# Altium schematic sheet POWERMANAGE2.SchDoc
size A3; SheetNumber: 11; SheetTotal: 13; SPICEModelCacheVRZJBZTH: <root> / <DocumentId>VRZJBZTH</DocumentId> / <CacheFrame Number="0"> / <Model Name="emk105bj105_v-f" Kind="CKT"> / <Text>* EMK105BJ105_V-F     SPICE MODEL  ( General Type ) / *-------------------------------------------------------------------------------------------------------- / * Model Generated by TAIYO YUDEN Corporation (http://www.ty-top.com) / * Version 1.0 / * TAIYO YUDEN Control No. 170508_130520 / * Copyright(c) 2012 TAIYO YUDEN CO.,LTD. All Rights Reserved. / *-------------------------------------------------------------------------------------------------------- / * / * Products Name : Multilayer Ceramic Capacitors / * / * Characteristics : / *     Capacitance : 1 uF , Rated Voltage : 16V , TCC : X5R / *     Case Size : 1.0 x 0.5 / 0.039 x 0.02 [mm/inch] , Thickness : 0.5 / 0.02 [mm/inch] / *     (Conditions: Temperature = 25 degC , DC Bias Current/Voltage = 0A / 0V) / * / * Frequency Range : 40Hz - 3GHz / * / * External Node Assignments : / * / *  1  o---| |---o  2 / * / *-------------------------------------------------------------------------------------------------------- / .SubCkt EMK105BJ105_V-F 1 2 / **************************** / C0 1 110 0.68309u / Cm 1 101 0.26053u / C1 101 102 0.94076u / Rc1 101 102 1.9029k / C2 102 103 0.66707u / Rc2 102 103 120.36 / C3 103 110 0.57203u / Rc3 103 110 2.1097 / C2m 1 301 0.1871u / C21 301 302 3.2494u / Rc21 301 302 1.1117k / C22 302 303 2.1014u / Rc22 302 303 1.484k / C23 303 304 2.1172u / Rc23 303 304 1.3876k / C24 304 305 0.75729u / Rc24 304 305 332.59 / C25 305 306 0.94401u / Rc25 305 306 249.09 / C26 306 307 0.34674u / Rc26 306 307 28.352 / C27 307 308 0.37158u / Rc27 307 308 19.989 / C28 308 309 0.17933u / Rc28 308 309 31.748 / C29 309 110 0.016445u / Rc29 309 110 1.0592 / Rp0 1 110 100Meg / L0 110 120 0.2216n / Lm 120 130 0.1509n / L1 120 121 0.12659n / RL1 121 130 0.85161 / L2 120 122 0.15996n / RL2 122 130 0.42469 / L3 120 123 7.9543n / RL3 123 130 0.54643m / CR 120 124 0.24334u / LR 124 125 0.090738n / RR 125 130 68.076m / CL 130 140 2.7354p / LL 130 140 0.10762n / RL 130 140 50.614 / Rs 140 2 7.5416m / **************************** / .ends EMK105BJ105_V-F</Text> / </Model> / </CacheFrame> / </root>
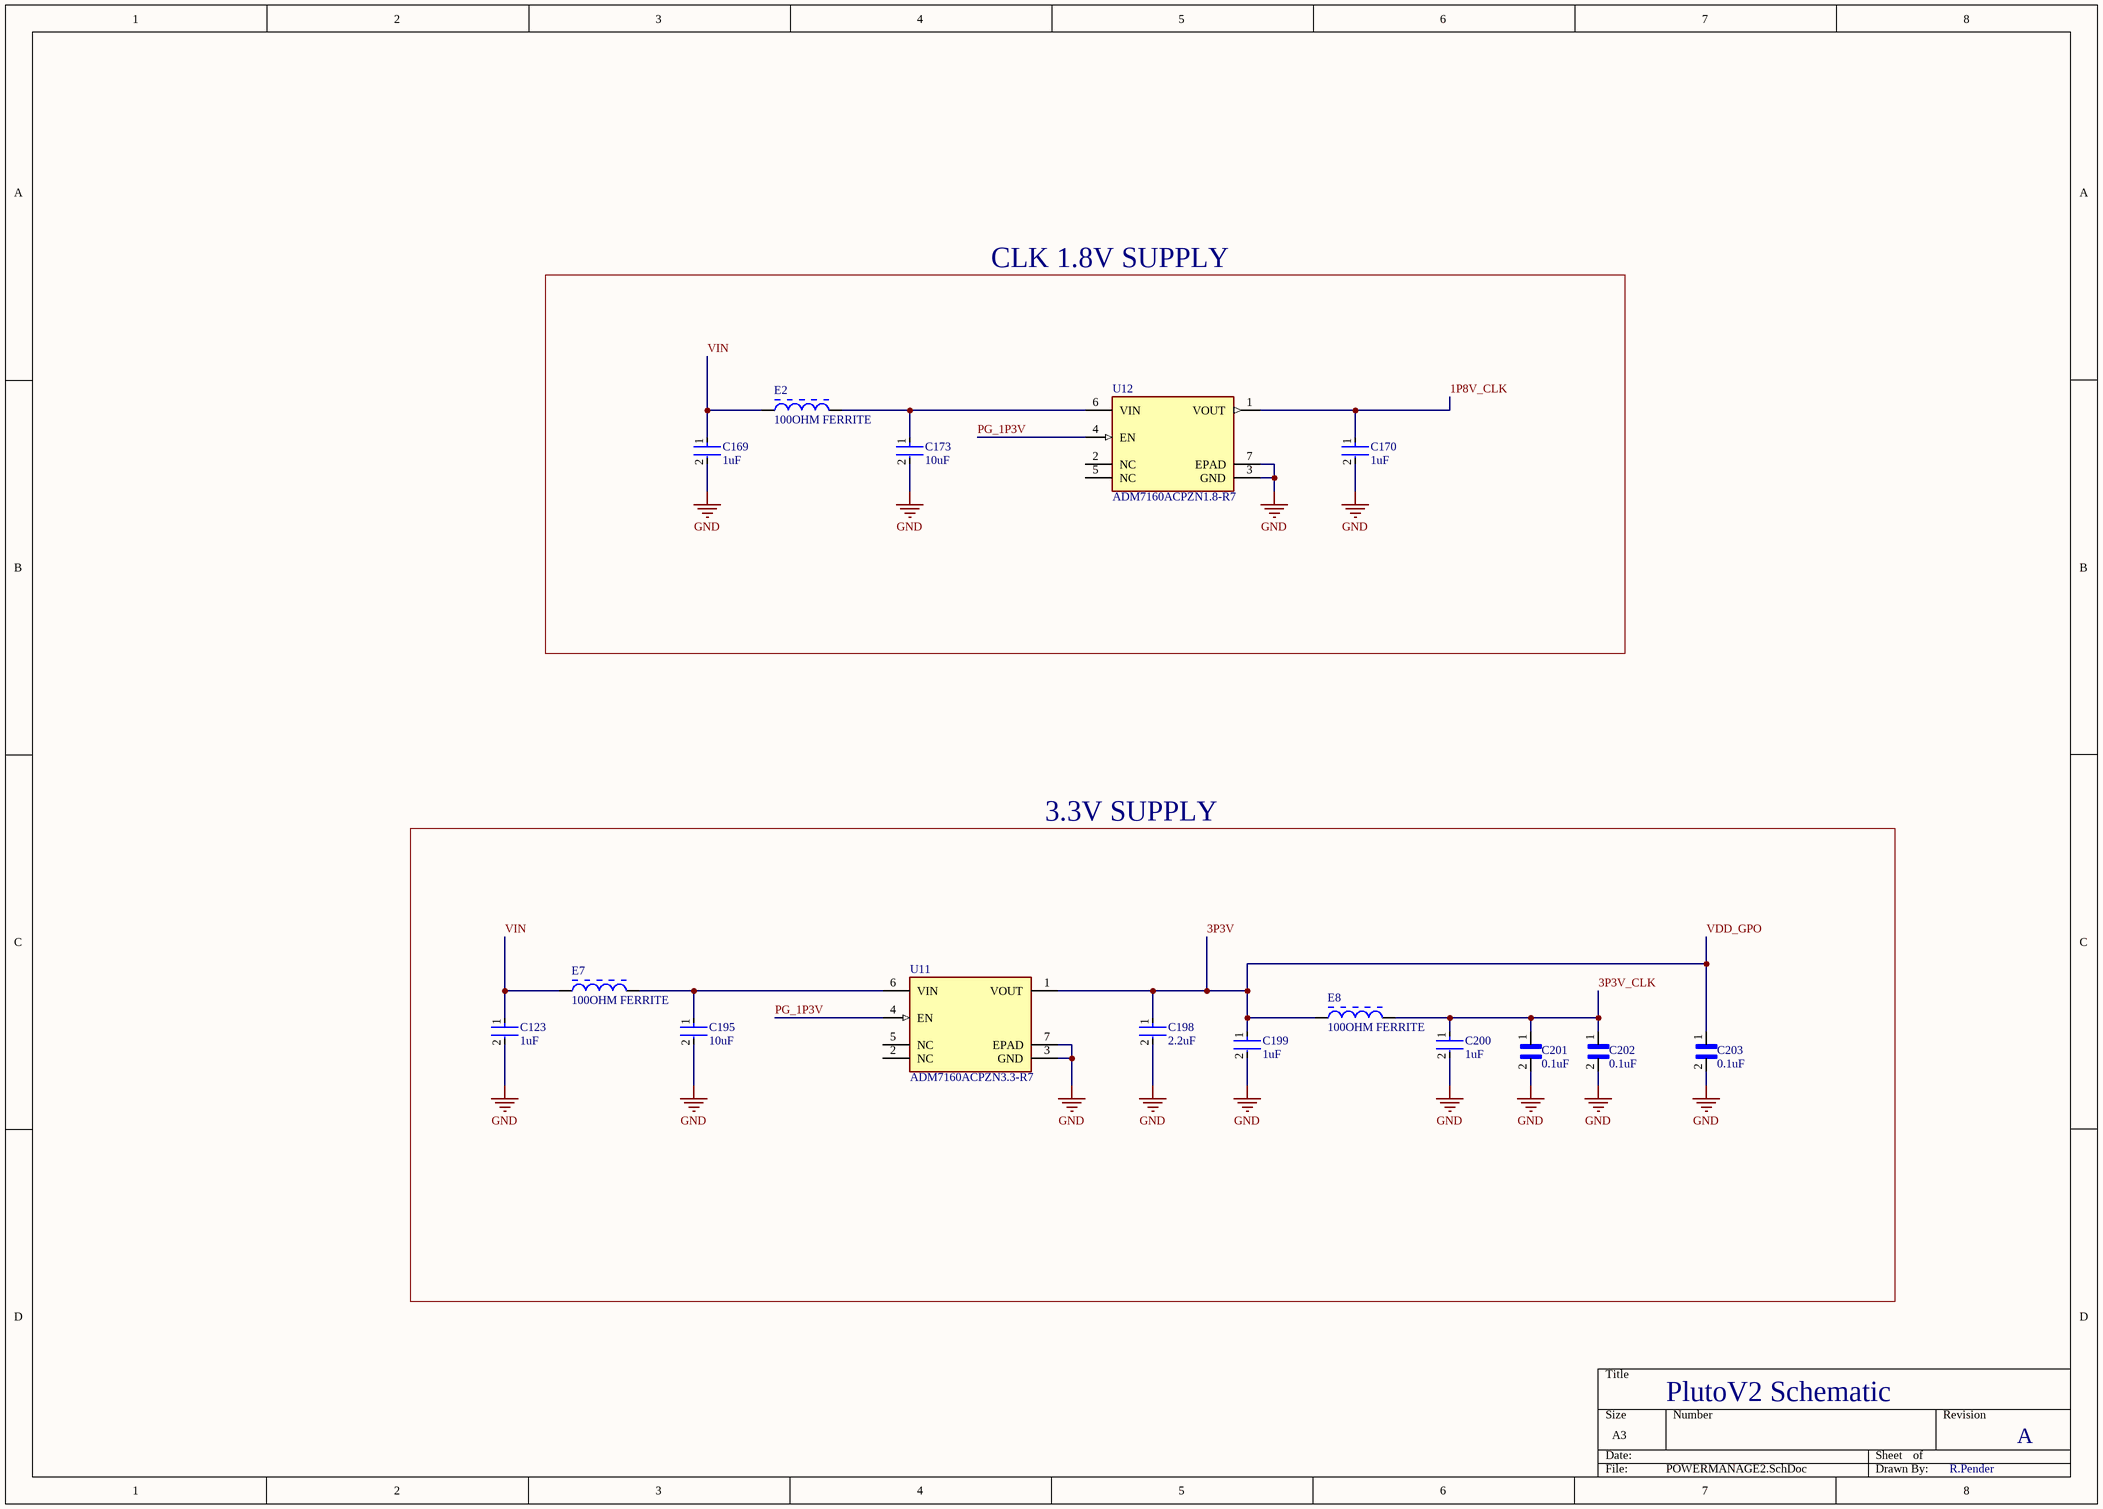
[diagram p0: POWERMANAGE2.SchDoc]

## Parts
C123  1uF  [FP-0402-L_1_0_0_05-W_0_5-IPC_A]
C169  1uF  [FP-0402-L_1_0_0_05-W_0_5-IPC_A]
C170  1uF  [FP-0402-L_1_0_0_05-W_0_5-IPC_B]
C173  10uF  [FP-GRM188-0_15-MFG]
C195  10uF  [FP-GRM188-0_15-MFG]
C198  2.2uF  [FP-GRM188-0_2-MFG]
C199  1uF  [FP-0402-L_1_0_0_05-W_0_5-IPC_A]
C200  1uF  [FP-0402-L_1_0_0_05-W_0_5-IPC_A]
C201  0.1uF  [CAPC0603X33N]
C202  0.1uF  [CAPC0603X33N]
C203  0.1uF  [CAPC0603X33N]
E2  100OHM FERRITE  [TDK-MPZ2012S101A-2_V]
E7  100OHM FERRITE  [TDK-MPZ2012S101A-2_V]
E8  100OHM FERRITE  [TDK-MPZ2012S101A-2_V]
U11  ADM7160ACPZN3.3-R7  [FP-CP-6-3-IPC_A]
U12  ADM7160ACPZN1.8-R7  [FP-CP-6-3-IPC_C]

## Blocks framed on the sheet
CLK 1.8V SUPPLY: C169 C170 C173 E2 U12
3.3V SUPPLY: C123 C195 C198-C203 E7 E8 U11

## Nets
GND: C123.2 C169.2 C170.2 C173.2 C195.2 C198.2 C199.2 C200.2 C201.2 C202.2 C203.2 U11.3(GND) U11.7(EPAD) U12.3(GND) U12.7(EPAD)
1P8V_CLK: C170.1 U12.1(VOUT)
3P3V: C198.1 C199.1 C203.1 E8.1 U11.1(VOUT)  [also labelled VDD_GPO]
3P3V_CLK: C200.1 C201.1 C202.1 E8.2
PG_1P3V: U11.4(EN) U12.4(EN)
VIN: C123.1 C169.1 E2.1 E7.1
NetC173_1: C173.1 E2.2 U12.6(VIN)
NetC195_1: C195.1 E7.2 U11.6(VIN)

Not connected (* = marked no-connect by the designer): U11 2(NC) 5(NC); U12 2(NC) 5(NC)

## Notes on the sheet
- PlutoV2 Schematic
- A
- R.Pender

## Library data of the parts
C123 C169 C170 C199 C200 = CMP-14477-000104-2: None; Tolerance: 10%; Voltage Rating: 16V; Dielectric: X5R; Packaging: Tape and Reel; Depth: 0.5mm; Mount: Surface Mount; Thickness: 0.022inch; Package Quantity: 1; Min Operating Temperature: -55°C; Series: M; Voltage Rating (DC): 16V; Termination: SMD/SMT; Case/Package: 0402; Number of Pins: 2; Case Code (Imperial): 0402; Capacitance: 1uF; Length: 1mm; Halogen Free: Halogen Free; Case Code (Metric): 1005; Width: 0.02inch; RoHS Compliant: Yes; Radiation Hardening: No; Max Operating Temperature: 85°C; Height: 0.5mm; Construction: Flat
C173 C195 = CMP-06035-003612-1: Chip Multilayer Ceramic Capacitors for General Purpose, 0603, 10uF, X5R, 15%, 20%, 10V; Tolerance: 20%; Dielectric: X5R; Package Quantity: 4000; Width: 0.8mm; Case/Package: 0603; Thickness: 0.035inch; Capacitance: 10uF; Voltage Rating: 10V; Voltage Rating (DC): 10V; Termination: SMD/SMT; Length: 1.6mm; Lead Free: Lead Free; Mount: Surface Mount; Height: 0.8mm; Depth: 0.8mm; Packaging: Tape and Reel; Weight: 0.000222oz; Min Operating Temperature: -55°C; Case Code (Metric): 1608; Max Operating Temperature: 85°C; Case Code (Imperial): 0603; Material: Ceramic
C198 = CMP-06035-023692-1: Chip Multilayer Ceramic Capacitors for General Purpose, 0603, 2.2uF, X5R, 15%, 10%, 50V; Mount: Surface Mount; Case/Package: 0603; Voltage Rating (DC): 50V; Weight: 0.000222oz; Capacitance: 2.2uF; Max Operating Temperature: 85°C; Length: 0.063inch; Thickness: 0.039inch; Dielectric: X5R; Min Operating Temperature: -55°C; Termination: SMD/SMT; Resistor Type: Ceramic; Width: 0.8mm; Voltage Rating: 50V; Height: 0.8mm; Tolerance: 10%; Case Code (Metric): 1608; Package Quantity: 10000; Packaging: Tape and Reel; Case Code (Imperial): 0603
C201-C203 = GRM033R61C104ME84D: CAP 0.1UF 16VDC X5R 20% SMD 0201 PAPER TAPE; Package: None; Price: None; Value: *; MP: GRM033R61C104ME84D; Availability: Unavailable
E2 E7 E8 = CMP-2000-05399-1: Chip Bead for Power Line, 100 Ohm, +/- 25%, 4 A, -55 to 125 degC, 0805 (2012 Metric), RoHS, Tape and Reel; Manufacturer: TDK; Maximum DC Resistance: 20mOhms; Test Frequency: 100MHz; Impedance: 100Ohms; Case Width: 1.25mm; Case Length: 2mm; Maximum DC Current: 4A; Case Height: 0.85mm; Package Reference: MPZ2012S101A-2; RoHS: Details; Tolerance: 25%; Operating Temperature Range: -55Cto+125C; Datasheet Version: Jul-13; Dimensions: 1.25mmWx2mmLx0.85mmH; Product: FerriteChipBeads; Termination Style: SMD/SMT; Datasheet URL: http://www.farnell.com/datasheets/1750041.pdf; Factory Pack Quantity: 4000; Brand: TDK; Packaging: Reel; Package Description: 2-Pin Surface Mount Device, Body 2 x 1.25 mm; Product Category: EMIFilterBeads,Chips&Arrays; Manufacturer URL: http://www.tdk.com/; Package / Case: 0805(2012metric)
U11 = CMP-09138-000129-1: IC REG LINEAR 3.3V 200MA 6LFCSP; Output Type: Fixed; Max Supply Current: 265uA; Max Input Voltage: 5.5V; Number of Regulators: 1; Power Supply Rejection Ratio (PSRR): 49dB; Operating Supply Current: 265mA; Polarity: Positive; Min Input Voltage: 2.2V; Dropout Voltage: 150mV; Accuracy: 1%; Min Current Limit: 220mA; Max Output Current: 200mA; RoHS Compliant: Yes; Case/Package: TSOT; Max Operating Temperature: 125°C; Contact Plating: Gold; Number of Pins: 6; Mount: Surface Mount; Packaging: Tape and Reel; Number of Outputs: 1; Lead Free: Contains Lead; Package Quantity: 3000; Min Operating Temperature: -40°C; Output Voltage: 3.3V; Output Current: 200mA; Quiescent Current: 265uA
U12 = CMP-09138-000112-1: IC REG LINEAR 1.8V 200MA 6LFCSP; Operating Supply Current: 265mA; Power Supply Rejection Ratio (PSRR): 49dB; Polarity: Positive; Max Supply Current: 265uA; Dropout Voltage: 230mV; Number of Outputs: 1; Min Current Limit: 220mA; Output Type: Fixed; Accuracy: 1%; Min Input Voltage: 2.2V; Max Input Voltage: 5.5V; Packaging: Tape and Reel; Case/Package: TSOT; Contact Plating: Gold; Mount: Surface Mount; Max Output Current: 200mA; Min Operating Temperature: -40°C; Output Voltage: 1.8V; Output Current: 200mA; Number of Pins: 6; Package Quantity: 3000; Lead Free: Contains Lead; Quiescent Current: 265uA; Max Operating Temperature: 125°C; Number of Regulators: 1; RoHS Compliant: Yes